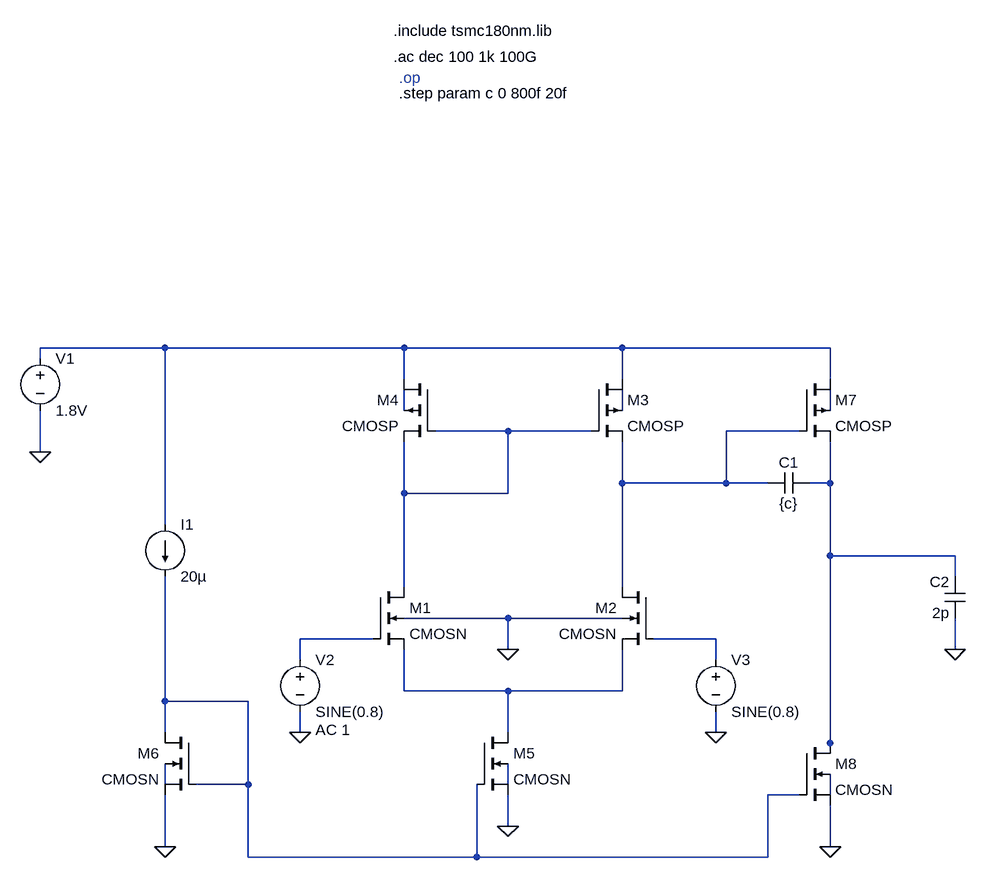
[diagram p0: schematic OpAmp 30-8.asc]
OpAmp 30-8.asc, the LTspice schematic file:
Version 4.1
SHEET 1 880 1016
WIRE -416 224 -608 224
WIRE -48 224 -416 224
WIRE 288 224 -48 224
WIRE 608 224 288 224
WIRE -608 240 -608 224
WIRE -48 272 -48 224
WIRE 288 272 288 224
WIRE 608 272 608 224
WIRE -48 320 -48 288
WIRE 288 320 288 288
WIRE 608 320 608 288
WIRE 112 352 0 352
WIRE 240 352 112 352
WIRE 560 352 448 352
WIRE -608 384 -608 320
WIRE 288 432 288 368
WIRE 448 432 448 352
WIRE 448 432 288 432
WIRE 512 432 448 432
WIRE 608 432 608 368
WIRE 608 432 576 432
WIRE -48 448 -48 368
WIRE 112 448 112 352
WIRE 112 448 -48 448
WIRE -416 496 -416 224
WIRE 608 544 608 432
WIRE 800 544 608 544
WIRE 800 576 800 544
WIRE -48 592 -48 448
WIRE 288 592 288 432
WIRE 112 640 -48 640
WIRE 288 640 112 640
WIRE -96 672 -208 672
WIRE 432 672 336 672
WIRE 112 688 112 640
WIRE 800 688 800 640
WIRE -208 704 -208 672
WIRE 432 704 432 672
WIRE -48 752 -48 688
WIRE 112 752 -48 752
WIRE 288 752 288 688
WIRE 288 752 112 752
WIRE -416 768 -416 576
WIRE -288 768 -416 768
WIRE -416 816 -416 768
WIRE -208 816 -208 784
WIRE 112 816 112 752
WIRE 432 816 432 784
WIRE 608 832 608 544
WIRE 608 848 608 832
WIRE -416 896 -416 864
WIRE -288 896 -288 768
WIRE -288 896 -368 896
WIRE 112 896 112 864
WIRE 560 912 512 912
WIRE 608 912 608 880
WIRE 112 960 112 912
WIRE -416 992 -416 912
WIRE 608 992 608 928
WIRE -288 1008 -288 896
WIRE 64 1008 64 896
WIRE 64 1008 -288 1008
WIRE 512 1008 512 912
WIRE 512 1008 64 1008
FLAG 112 960 0
FLAG 608 992 0
FLAG -416 992 0
FLAG -608 384 0
FLAG 800 688 0
FLAG 112 688 0
FLAG -208 816 0
FLAG 432 816 0
SYMBOL cmosn -96 592 R0
SYMATTR InstName M1
SYMATTR Value2 l=500n w=3.09u
SYMBOL cmosn 336 592 M0
SYMATTR InstName M2
SYMATTR Value2 l=500n w=3.09u
SYMBOL cmosp 240 272 R0
SYMATTR InstName M3
SYMATTR Value2 l=500n w=4.75u
SYMBOL cmosp 0 272 M0
SYMATTR InstName M4
SYMATTR Value2 l=500n w=4.75u
SYMBOL cmosn 64 816 R0
SYMATTR InstName M5
SYMATTR Value2 l=500n w=2.85u
SYMBOL cmosn -368 816 M0
SYMATTR InstName M6
SYMATTR Value2 l=500n w=2.85u
SYMBOL cmosp 560 272 R0
SYMATTR InstName M7
SYMATTR Value2 l=500n w=63u
SYMBOL cap 576 416 R90
WINDOW 0 0 32 VBottom 2
WINDOW 3 32 32 VTop 2
SYMATTR InstName C1
SYMATTR Value {c}
SYMBOL cmosn 560 832 R0
SYMATTR InstName M8
SYMATTR Value2 l=500n w=20u
SYMBOL voltage -608 224 R0
WINDOW 123 0 0 Left 0
WINDOW 39 0 0 Left 0
SYMATTR InstName V1
SYMATTR Value 1.8V
SYMBOL current -416 496 R0
WINDOW 123 0 0 Left 0
WINDOW 39 0 0 Left 0
SYMATTR InstName I1
SYMATTR Value 20µ
SYMBOL cap 816 640 R180
WINDOW 0 24 56 Left 2
WINDOW 3 24 8 Left 2
SYMATTR InstName C2
SYMATTR Value 2p
SYMBOL voltage -208 688 R0
WINDOW 123 24 124 Left 2
WINDOW 39 0 0 Left 0
SYMATTR Value2 AC 1
SYMATTR InstName V2
SYMATTR Value SINE(0.8)
SYMBOL voltage 432 688 R0
WINDOW 123 0 0 Left 0
WINDOW 39 0 0 Left 0
SYMATTR InstName V3
SYMATTR Value SINE(0.8)
TEXT -64 -264 Left 2 !.include tsmc180nm.lib
TEXT -64 -224 Left 2 !.ac dec 100 1k 100G
TEXT -56 -192 Left 2 ;.op
TEXT -56 -168 Left 2 !.step param c 0 800f 20f

The netlist it stands for:
* OpAmp 30-8.asc
M1 N005 N008 N010 0 CMOSN l=500n w=3.09u
M2 N006 N009 N010 0 CMOSN l=500n w=3.09u
M3 N001 N005 N006 N003 CMOSP l=500n w=4.75u
M4 N001 N005 N005 N002 CMOSP l=500n w=4.75u
M5 N010 N011 0 N013 CMOSN l=500n w=2.85u
M6 N011 N011 0 N012 CMOSN l=500n w=2.85u
M7 N001 N006 N007 N004 CMOSP l=500n w=63u
C1 N007 N006 {c}
M8 N007 N011 0 N014 CMOSN l=500n w=20u
V1 N001 0 1.8V
I1 N001 N011 20µ
C2 0 N007 2p
V2 N008 0 SINE(0.8) AC 1
V3 N009 0 SINE(0.8)
.model NMOS NMOS
.model PMOS PMOS
.lib standard.mos
.include tsmc180nm.lib
.ac dec 100 1k 100G
* .op
.step param c 0 800f 20f
.backanno
.end